# Altium project roach2_project rev2.PrjPCB (part 13 of 13)
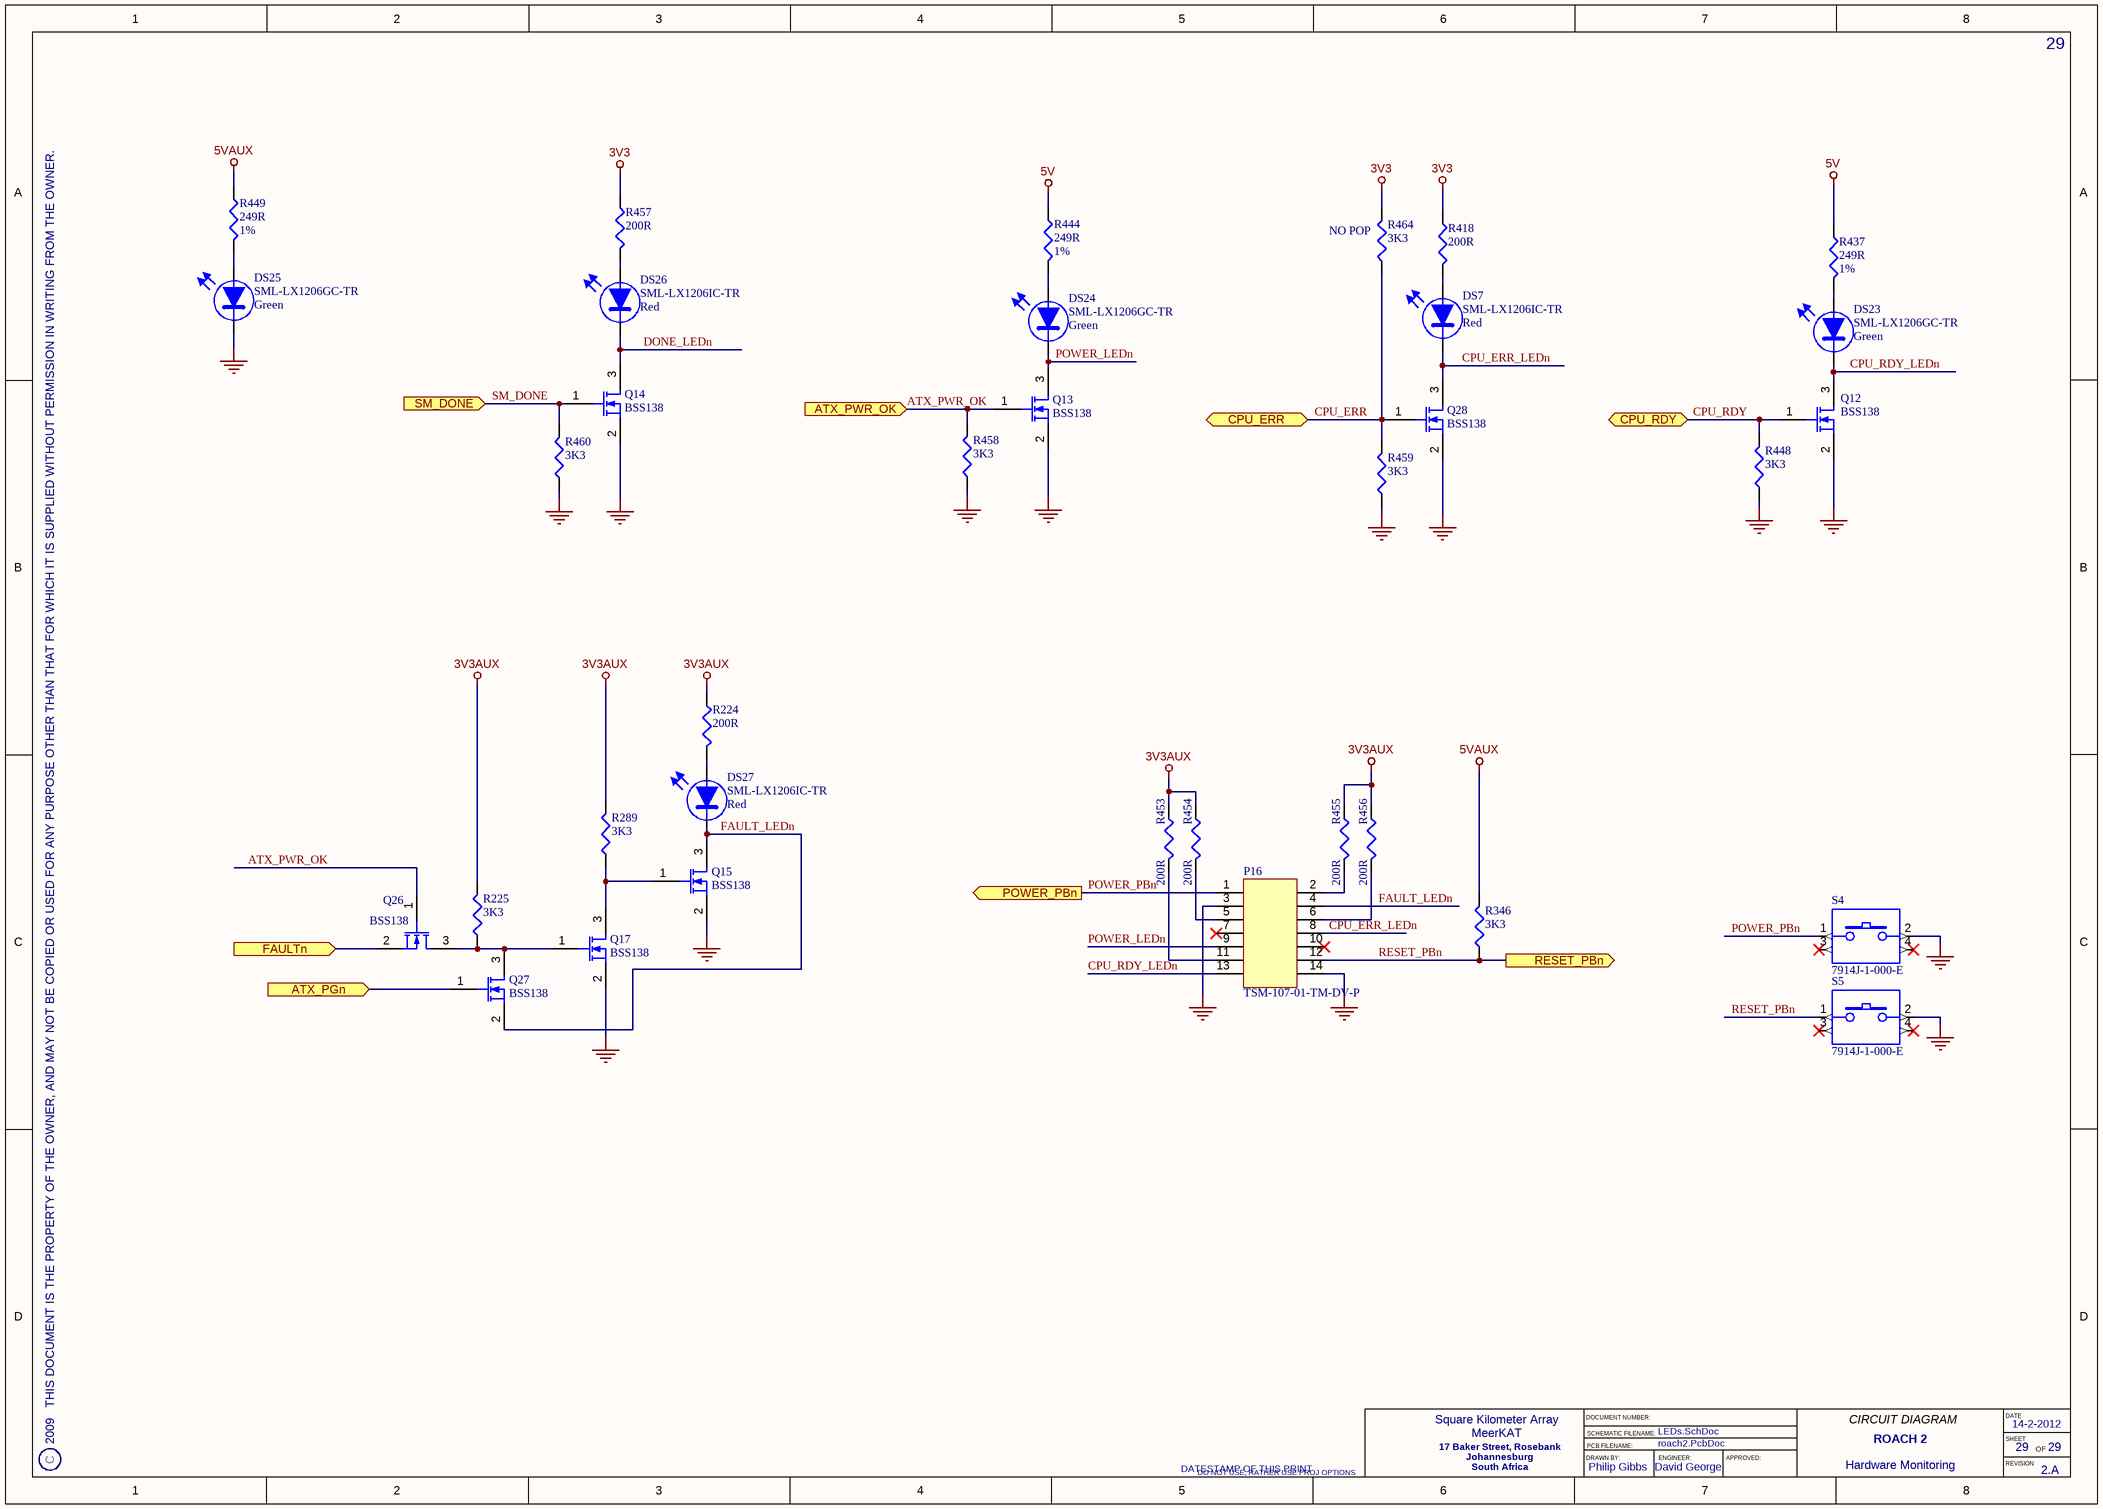
[diagram p27: LEDs.SchDoc]

## Nets that join several sheets (continued)
SM_RDWRn: ppc_serial (R143.2), v6_config_io_16_17_21_22 (U1.J10)
SYS_CLK_N: gpio_led (U72.4), v6_io_34_35_36_37_38 (U1.AP12)
SYS_CLK_P: gpio_led (U72.5), v6_io_34_35_36_37_38 (U1.AP11)
SYS_PORn: power_supply (R20.2), ppc_cpld (U46.99), ppc_extbus (U30.B5), ppc_net (R231.1), ppc_serial (U31.6 U83.6), ppc_sys (5 pins), v6_net (R402.1)
SYS_WPn: ppc_cpld (R343.1 U46.32), ppc_extbus (U30.B4), ppc_serial (Q11.1)
THERM_ALERTn: hwmon_1 (R75.1 U15.5 U18.5 U22.12), ppc_sys (R87.1 U2.U34)
TRC_HALT: jtag_levelxlate (P17.11), ppc_serial (R270.2), ppc_sys (P2.7 R96.1 U2.E32)
V6_GPIO0: gpio_led (P15.17 SP36.2 U68.3), v6_io_27_28_32_33 (U1.G31)
V6_GPIO1: gpio_led (P15.15 SP35.2 U68.4), v6_io_27_28_32_33 (U1.H31)
V6_GPIO2: gpio_led (P15.13 SP34.2 U68.5), v6_io_12_13_14_15 (U1.AF32)
V6_GPIO3: gpio_led (P15.11 SP33.2 U68.6), v6_io_12_13_14_15 (U1.AG33)
V6_GPIO4: gpio_led (P15.9 SP32.2 U68.7), v6_io_27_28_32_33 (U1.L30)
V6_GPIO5: gpio_led (P15.7 SP31.2 U68.8), v6_io_27_28_32_33 (U1.H30)
V6_GPIO6: gpio_led (P15.5 SP30.2 U68.9), v6_io_27_28_32_33 (U1.M29)
V6_GPIO7: gpio_led (P15.3 SP29.2 U68.10), v6_io_27_28_32_33 (U1.J30)
V6_GPIO8: gpio_led (P13.17 SP28.2), v6_io_27_28_32_33 (U1.M28)
V6_GPIO9: gpio_led (P13.15 SP27.2), v6_io_27_28_32_33 (U1.K30)
V6_GPIO10: gpio_led (P13.13 SP26.2), v6_io_34_35_36_37_38 (U1.N19)
V6_GPIO11: gpio_led (P13.11 SP25.2), v6_io_34_35_36_37_38 (U1.N20)
V6_GPIO12: gpio_led (P13.9 SP46.2), v6_io_34_35_36_37_38 (U1.H18)
V6_GPIO13: gpio_led (P13.7 SP45.2), v6_io_34_35_36_37_38 (U1.F16)
V6_GPIO14: gpio_led (P13.5 SP44.2), v6_io_27_28_32_33 (U1.E29)
V6_GPIO15: gpio_led (P13.3 SP43.2), v6_io_27_28_32_33 (U1.M27)
V6_IRQn: ppc_sys (R86.1 U2.AD34), v6_io_34_35_36_37_38 (U1.AY17)
V6_TCK: jtag_levelxlate (U77.18), v6_config_io_16_17_21_22 (U1.AN10)
V6_TDI: jtag_levelxlate (R478.2), v6_config_io_16_17_21_22 (U1.AP10)
V6_TDO: jtag_levelxlate (R479.1), v6_config_io_16_17_21_22 (U1.AR10)
V6_THERM_N: hwmon_1 (C611.1 U22.4), v6_config_io_16_17_21_22 (U1.AC21)
V6_THERM_P: hwmon_1 (C611.2 U22.3), v6_config_io_16_17_21_22 (U1.AC22)
V6_TMS: jtag_levelxlate (U79.12), v6_config_io_16_17_21_22 (U1.AN11)
V6NET_TCK: jtag_levelxlate (U77.9), v6_net (U64.L9)
V6NET_TDI: jtag_levelxlate (R485.2), v6_net (U64.L7)
V6NET_TDO: jtag_levelxlate (R486.1), v6_net (U64.K8)
V6NET_TMS: jtag_levelxlate (U79.3), v6_net (U64.L8)
VMON_TCK: hwmon_1 (U16.11), jtag_levelxlate (U79.16)
VMON_TDI: hwmon_1 (U16.10), jtag_levelxlate (R488.2)
VMON_TDO: hwmon_1 (U16.12), jtag_levelxlate (R489.1 U53.3)
VMON_TMS: hwmon_1 (U16.9), jtag_levelxlate (U82.9)
XL.DOEn: jtag_levelxlate (R476.1 U75.3), v6_io_12_13_14_15 (U1.AF35)
XL.PADDR5: jtag_levelxlate (U76.2), v6_io_34_35_36_37_38 (U1.AT14)
XL.PADDR6: jtag_levelxlate (U76.3), v6_io_34_35_36_37_38 (U1.AR14)
XL.PADDR7: jtag_levelxlate (U76.5), v6_io_34_35_36_37_38 (U1.AR15)
XL.PADDR8: jtag_levelxlate (U76.6), v6_io_34_35_36_37_38 (U1.AP15)
XL.PADDR9: jtag_levelxlate (U76.8), v6_io_34_35_36_37_38 (U1.AN13)
XL.PADDR10: jtag_levelxlate (U76.9), v6_io_34_35_36_37_38 (U1.AN14)
XL.PADDR11: jtag_levelxlate (U76.10), v6_io_34_35_36_37_38 (U1.AM12)
XL.PADDR12: jtag_levelxlate (U76.12), v6_io_34_35_36_37_38 (U1.AM13)
XL.PADDR13: jtag_levelxlate (U76.13), v6_io_34_35_36_37_38 (U1.AV14)
XL.PADDR14: jtag_levelxlate (U76.14), v6_io_23_24_25_26 (U1.AJ32)
XL.PADDR15: jtag_levelxlate (U76.15), v6_io_23_24_25_26 (U1.AJ31)
XL.PADDR16: jtag_levelxlate (U76.16), v6_io_23_24_25_26 (U1.AK30)
XL.PADDR17: jtag_levelxlate (U76.17), v6_io_23_24_25_26 (U1.AJ30)
XL.PADDR18: jtag_levelxlate (U76.19), v6_io_23_24_25_26 (U1.AK33)
XL.PADDR19: jtag_levelxlate (U76.20), v6_io_23_24_25_26 (U1.AH30)
XL.PADDR20: jtag_levelxlate (U76.21), v6_io_23_24_25_26 (U1.AH29)
XL.PADDR21: jtag_levelxlate (U76.23), v6_io_23_24_25_26 (U1.AG29)
XL.PADDR22: jtag_levelxlate (U76.24), v6_io_23_24_25_26 (U1.AD30)
XL.PADDR23: jtag_levelxlate (U80.2), v6_io_23_24_25_26 (U1.AC30)
XL.PADDR24: jtag_levelxlate (U76.26), v6_io_34_35_36_37_38 (U1.AY13)
XL.PADDR25: jtag_levelxlate (U76.27), v6_io_34_35_36_37_38 (U1.AV13)
XL.PADDR26: jtag_levelxlate (U80.3), v6_io_23_24_25_26 (U1.AD31)
XL.PADDR27: jtag_levelxlate (U80.5), v6_io_23_24_25_26 (U1.AB31)
XL.PADDR28: jtag_levelxlate (U80.6), v6_io_23_24_25_26 (U1.AC31)
XL.PADDR29: jtag_levelxlate (U80.8), v6_io_23_24_25_26 (U1.AA30)
XL.PBEn0: jtag_levelxlate (U80.13), v6_io_23_24_25_26 (U1.Y30)
XL.PBEn1: jtag_levelxlate (U80.12), v6_io_23_24_25_26 (U1.W31)
XL.PBEn2: jtag_levelxlate (U80.10), v6_io_23_24_25_26 (U1.R32)
XL.PBEn3: jtag_levelxlate (U80.9), v6_io_23_24_25_26 (U1.T32)
XL.PBLASTn: jtag_levelxlate (U80.16), v6_config_io_16_17_21_22 (U1.N34)
XL.PCSn0: jtag_levelxlate (TP43.1 U80.19), v6_config_io_16_17_21_22 (U1.N35)
XL.PCSn1: jtag_levelxlate (U80.17), v6_config_io_16_17_21_22 (U1.L39)
XL.PCSn2: jtag_levelxlate (U80.20), v6_config_io_16_17_21_22 (R260.1 U1.T10)
XL.PDATA0: jtag_levelxlate (U81.2), v6_io_34_35_36_37_38 (U1.AR13)
XL.PDATA1: jtag_levelxlate (U81.3), v6_io_34_35_36_37_38 (U1.AP13)
XL.PDATA2: jtag_levelxlate (U81.5), v6_io_34_35_36_37_38 (U1.AU14)
XL.PDATA3: jtag_levelxlate (U81.6), v6_io_34_35_36_37_38 (U1.AV15)
XL.PDATA4: jtag_levelxlate (U81.8), v6_io_34_35_36_37_38 (U1.AT12)
XL.PDATA5: jtag_levelxlate (U81.9), v6_io_34_35_36_37_38 (U1.AR12)
XL.PDATA6: jtag_levelxlate (U81.11), v6_io_34_35_36_37_38 (U1.BA14)
XL.PDATA7: jtag_levelxlate (U81.12), v6_io_34_35_36_37_38 (U1.BA15)
XL.PDATA8: jtag_levelxlate (U81.13), v6_io_34_35_36_37_38 (U1.AW13)
XL.PDATA9: jtag_levelxlate (U81.14), v6_io_34_35_36_37_38 (U1.AW12)
XL.PDATA10: jtag_levelxlate (U81.16), v6_io_34_35_36_37_38 (U1.BB14)
XL.PDATA11: jtag_levelxlate (U81.17), v6_io_34_35_36_37_38 (U1.BB13)
XL.PDATA12: jtag_levelxlate (U81.19), v6_io_34_35_36_37_38 (U1.AU13)
XL.PDATA13: jtag_levelxlate (U81.20), v6_io_34_35_36_37_38 (U1.AU12)
XL.PDATA14: jtag_levelxlate (U81.22), v6_io_34_35_36_37_38 (U1.AW15)
XL.PDATA15: jtag_levelxlate (U81.23), v6_io_34_35_36_37_38 (U1.AY15)
XL.PDATA16: jtag_levelxlate (U78.2), v6_io_23_24_25_26 (U1.P33)
XL.PDATA17: jtag_levelxlate (U78.3), v6_io_23_24_25_26 (U1.N33)
XL.PDATA18: jtag_levelxlate (U78.5), v6_io_23_24_25_26 (U1.AG31)
XL.PDATA19: jtag_levelxlate (U78.6), v6_io_23_24_25_26 (U1.AH31)
XL.PDATA20: jtag_levelxlate (U78.8), v6_io_23_24_25_26 (U1.R30)
XL.PDATA21: jtag_levelxlate (U78.9), v6_io_23_24_25_26 (U1.T30)
XL.PDATA22: jtag_levelxlate (U78.11), v6_io_23_24_25_26 (U1.AF31)
XL.PDATA23: jtag_levelxlate (U78.12), v6_io_23_24_25_26 (U1.AG32)
XL.PDATA24: jtag_levelxlate (U78.13), v6_io_23_24_25_26 (U1.U31)
XL.PDATA25: jtag_levelxlate (U78.14), v6_io_23_24_25_26 (U1.T31)
XL.PDATA26: jtag_levelxlate (U78.16), v6_io_23_24_25_26 (U1.AL32)
XL.PDATA27: jtag_levelxlate (U78.17), v6_io_23_24_25_26 (U1.AK32)
XL.PDATA28: jtag_levelxlate (U78.19), v6_io_23_24_25_26 (U1.R33)
XL.PDATA29: jtag_levelxlate (U78.20), v6_io_23_24_25_26 (U1.P32)
XL.PDATA30: jtag_levelxlate (U78.22), v6_io_23_24_25_26 (U1.AH33)
XL.PDATA31: jtag_levelxlate (TP42.1 U78.23), v6_io_23_24_25_26 (U1.AJ33)
XL.PERCLK: jtag_levelxlate (6 pins), v6_config_io_16_17_21_22 (U1.K10), v6_io_34_35_36_37_38 (U1.AY14)
XL.POEn: jtag_levelxlate (U80.14), v6_io_23_24_25_26 (U1.AA31)
XL.PRDY: jtag_levelxlate (R230.1 U86.1), v6_config_io_16_17_21_22 (U1.L40)
XL.PWRn: jtag_levelxlate (U80.15), v6_io_23_24_25_26 (U1.V31)
ZDOK0.CLK0_N: v6_io_23_24_25_26 (U1.K42), zdoks (P10.C20)
ZDOK0.CLK0_P: v6_io_23_24_25_26 (U1.J42), zdoks (P10.C19)
ZDOK0.CLK1_N: v6_io_23_24_25_26 (U1.P31), zdoks (P10.F20)
ZDOK0.CLK1_P: v6_io_23_24_25_26 (U1.P30), zdoks (P10.F19)
ZDOK0.DP_N0: v6_io_23_24_25_26 (U1.R27), zdoks (P10.A2)
ZDOK0.DP_N1: v6_io_23_24_25_26 (U1.N31), zdoks (P10.A4)
ZDOK0.DP_N2: v6_io_23_24_25_26 (U1.L36), zdoks (P10.A6)
ZDOK0.DP_N3: v6_io_23_24_25_26 (U1.K34), zdoks (P10.A8)
ZDOK0.DP_N4: v6_io_23_24_25_26 (U1.H35), zdoks (P10.A10)
ZDOK0.DP_N5: v6_io_23_24_25_26 (U1.G42), zdoks (P10.A12)
ZDOK0.DP_N6: v6_io_23_24_25_26 (U1.G36), zdoks (P10.A14)
ZDOK0.DP_N7: v6_io_23_24_25_26 (U1.C39), zdoks (P10.A16)
ZDOK0.DP_N8: v6_io_23_24_25_26 (U1.A39), zdoks (P10.A18)
ZDOK0.DP_N9: v6_io_23_24_25_26 (U1.B42), zdoks (P10.A20)
ZDOK0.DP_N10: v6_io_23_24_25_26 (U1.P28), zdoks (P10.D2)
ZDOK0.DP_N11: v6_io_23_24_25_26 (U1.L37), zdoks (P10.D4)
ZDOK0.DP_N12: v6_io_23_24_25_26 (U1.K32), zdoks (P10.D6)
ZDOK0.DP_N13: v6_io_23_24_25_26 (U1.K40), zdoks (P10.D8)
ZDOK0.DP_N14: v6_io_23_24_25_26 (U1.H41), zdoks (P10.D10)
ZDOK0.DP_N15: v6_io_23_24_25_26 (U1.G38), zdoks (P10.D12)
ZDOK0.DP_N16: v6_io_23_24_25_26 (U1.F42), zdoks (P10.D14)
ZDOK0.DP_N17: v6_io_23_24_25_26 (U1.C41), zdoks (P10.D16)
ZDOK0.DP_N18: v6_io_23_24_25_26 (U1.E38), zdoks (P10.D18)
ZDOK0.DP_N19: v6_io_23_24_25_26 (U1.A37), zdoks (P10.D20)
ZDOK0.DP_N20: v6_io_23_24_25_26 (U1.R29), zdoks (P10.C2)
ZDOK0.DP_N21: v6_config_io_16_17_21_22 (U1.M37), v6_io_23_24_25_26 (U1.M32), zdoks (P10.C4)
ZDOK0.DP_N22: v6_io_23_24_25_26 (U1.N30), zdoks (P10.C6)
ZDOK0.DP_N23: v6_io_23_24_25_26 (U1.M34), zdoks (P10.C8)
ZDOK0.DP_N24: v6_io_23_24_25_26 (U1.H34), zdoks (P10.C10)
ZDOK0.DP_N25: v6_io_23_24_25_26 (U1.G39), zdoks (P10.C12)
ZDOK0.DP_N26: v6_io_23_24_25_26 (U1.E37), zdoks (P10.C14)
ZDOK0.DP_N27: v6_io_23_24_25_26 (U1.D41), zdoks (P10.C16)
ZDOK0.DP_N28: v6_io_23_24_25_26 (U1.A41), zdoks (P10.C18)
ZDOK0.DP_N29: v6_io_23_24_25_26 (U1.L32), zdoks (P10.F2)
ZDOK0.DP_N30: v6_io_23_24_25_26 (U1.J36), zdoks (P10.F4)
ZDOK0.DP_N31: v6_io_23_24_25_26 (U1.J41), zdoks (P10.F6)
ZDOK0.DP_N32: v6_io_23_24_25_26 (U1.J38), zdoks (P10.F8)
ZDOK0.DP_N33: v6_io_23_24_25_26 (U1.H38), zdoks (P10.F10)
ZDOK0.DP_N34: v6_io_23_24_25_26 (U1.E40), zdoks (P10.F12)
ZDOK0.DP_N35: v6_io_23_24_25_26 (U1.F41), zdoks (P10.F14)
ZDOK0.DP_N36: v6_io_23_24_25_26 (U1.F36), zdoks (P10.F16)
ZDOK0.DP_N37: v6_io_23_24_25_26 (U1.C38), zdoks (P10.F18)
ZDOK0.DP_P0: v6_io_23_24_25_26 (U1.P27), zdoks (P10.A1)
ZDOK0.DP_P1: v6_io_23_24_25_26 (U1.M31), zdoks (P10.A3)
ZDOK0.DP_P2: v6_io_23_24_25_26 (U1.L35), zdoks (P10.A5)
ZDOK0.DP_P3: v6_io_23_24_25_26 (U1.K35), zdoks (P10.A7)
ZDOK0.DP_P4: v6_io_23_24_25_26 (U1.J35), zdoks (P10.A9)
ZDOK0.DP_P5: v6_io_23_24_25_26 (U1.G41), zdoks (P10.A11)
ZDOK0.DP_P6: v6_io_23_24_25_26 (U1.H36), zdoks (P10.A13)
ZDOK0.DP_P7: v6_io_23_24_25_26 (U1.B39), zdoks (P10.A15)
ZDOK0.DP_P8: v6_io_23_24_25_26 (U1.B38), zdoks (P10.A17)
ZDOK0.DP_P9: v6_io_23_24_25_26 (U1.B41), zdoks (P10.A19)
ZDOK0.DP_P10: v6_io_23_24_25_26 (U1.N28), zdoks (P10.D1)
ZDOK0.DP_P11: v6_io_23_24_25_26 (U1.K37), zdoks (P10.D3)
ZDOK0.DP_P12: v6_io_23_24_25_26 (U1.K33), zdoks (P10.D5)
ZDOK0.DP_P13: v6_io_23_24_25_26 (U1.K39), zdoks (P10.D7)
ZDOK0.DP_P14: v6_io_23_24_25_26 (U1.H40), zdoks (P10.D9)
ZDOK0.DP_P15: v6_io_23_24_25_26 (U1.G37), zdoks (P10.D11)
ZDOK0.DP_P16: v6_io_23_24_25_26 (U1.E42), zdoks (P10.D13)
ZDOK0.DP_P17: v6_io_23_24_25_26 (U1.C40), zdoks (P10.D15)
ZDOK0.DP_P18: v6_io_23_24_25_26 (U1.E39), zdoks (P10.D17)
ZDOK0.DP_P19: v6_io_23_24_25_26 (U1.B37), zdoks (P10.D19)
ZDOK0.DP_P20: v6_io_23_24_25_26 (U1.R28), zdoks (P10.C1)
ZDOK0.DP_P21: v6_config_io_16_17_21_22 (U1.M36), v6_io_23_24_25_26 (U1.M33), zdoks (P10.C3)
ZDOK0.DP_P22: v6_io_23_24_25_26 (U1.N29), zdoks (P10.C5)
ZDOK0.DP_P23: v6_io_23_24_25_26 (U1.L34), zdoks (P10.C7)
ZDOK0.DP_P24: v6_io_23_24_25_26 (U1.G34), zdoks (P10.C9)
ZDOK0.DP_P25: v6_io_23_24_25_26 (U1.F39), zdoks (P10.C11)
ZDOK0.DP_P26: v6_io_23_24_25_26 (U1.F37), zdoks (P10.C13)
ZDOK0.DP_P27: v6_io_23_24_25_26 (U1.D42), zdoks (P10.C15)
ZDOK0.DP_P28: v6_io_23_24_25_26 (U1.A40), zdoks (P10.C17)
ZDOK0.DP_P29: v6_io_23_24_25_26 (U1.L31), zdoks (P10.F1)
ZDOK0.DP_P30: v6_io_23_24_25_26 (U1.J37), zdoks (P10.F3)
ZDOK0.DP_P31: v6_io_23_24_25_26 (U1.J40), zdoks (P10.F5)
ZDOK0.DP_P32: v6_io_23_24_25_26 (U1.K38), zdoks (P10.F7)
ZDOK0.DP_P33: v6_io_23_24_25_26 (U1.H39), zdoks (P10.F9)
ZDOK0.DP_P34: v6_io_23_24_25_26 (U1.D40), zdoks (P10.F11)
ZDOK0.DP_P35: v6_io_23_24_25_26 (U1.F40), zdoks (P10.F13)
ZDOK0.DP_P36: v6_io_23_24_25_26 (U1.F35), zdoks (P10.F15)
ZDOK0.DP_P37: v6_io_23_24_25_26 (U1.D38), zdoks (P10.F17)
ZDOK1.CLK0_N: v6_io_23_24_25_26 (U1.V30), zdoks (P11.C20)
ZDOK1.CLK0_P: v6_io_23_24_25_26 (U1.W30), zdoks (P11.C19)
ZDOK1.CLK1_N: v6_io_23_24_25_26 (U1.AF30), zdoks (P11.F20)
ZDOK1.CLK1_P: v6_io_23_24_25_26 (U1.AE30), zdoks (P11.F19)
ZDOK1.DP_N0: v6_config_io_16_17_21_22 (U1.Y34), zdoks (P11.A2)
ZDOK1.DP_N1: v6_config_io_16_17_21_22 (U1.Y37), zdoks (P11.A4)
ZDOK1.DP_N2: v6_config_io_16_17_21_22 (U1.V35), zdoks (P11.A6)
ZDOK1.DP_N3: v6_config_io_16_17_21_22 (U1.U33), zdoks (P11.A8)
ZDOK1.DP_N4: v6_config_io_16_17_21_22 (U1.U41), zdoks (P11.A10)
ZDOK1.DP_N5: v6_config_io_16_17_21_22 (U1.T37), zdoks (P11.A12)
ZDOK1.DP_N6: v6_config_io_16_17_21_22 (U1.R34), zdoks (P11.A14)
ZDOK1.DP_N7: v6_config_io_16_17_21_22 (U1.P35), zdoks (P11.A16)
ZDOK1.DP_N8: v6_config_io_16_17_21_22 (U1.M42), zdoks (P11.A18)
ZDOK1.DP_N9: v6_config_io_16_17_21_22 (U1.L42), zdoks (P11.A20)
ZDOK1.DP_N10: v6_config_io_16_17_21_22 (U1.Y32), zdoks (P11.D2)
ZDOK1.DP_N11: v6_config_io_16_17_21_22 (U1.AA39), zdoks (P11.D4)
ZDOK1.DP_N12: v6_config_io_16_17_21_22 (U1.W33), zdoks (P11.D6)
ZDOK1.DP_N13: v6_config_io_16_17_21_22 (U1.W41), zdoks (P11.D8)
ZDOK1.DP_N14: v6_config_io_16_17_21_22 (U1.V39), zdoks (P11.D10)
ZDOK1.DP_N15: v6_config_io_16_17_21_22 (U1.T36), zdoks (P11.D12)
ZDOK1.DP_N16: v6_config_io_16_17_21_22 (U1.T42), zdoks (P11.D14)
ZDOK1.DP_N17: v6_config_io_16_17_21_22 (U1.P38), zdoks (P11.D16)
ZDOK1.DP_N19: v6_config_io_16_17_21_22 (U1.N41), zdoks (P11.D20)
ZDOK1.DP_N20: v6_config_io_16_17_21_22 (U1.Y35), zdoks (P11.C2)
ZDOK1.DP_N21: v6_config_io_16_17_21_22 (U1.Y33), zdoks (P11.C4)
ZDOK1.DP_N22: v6_config_io_16_17_21_22 (U1.V36), zdoks (P11.C6)
ZDOK1.DP_N23: v6_config_io_16_17_21_22 (U1.W40), zdoks (P11.C8)
ZDOK1.DP_N24: v6_config_io_16_17_21_22 (U1.U38), zdoks (P11.C10)
ZDOK1.DP_N25: v6_config_io_16_17_21_22 (U1.R38), zdoks (P11.C12)
ZDOK1.DP_N26: v6_config_io_16_17_21_22 (U1.R42), zdoks (P11.C14)
ZDOK1.DP_N27: v6_config_io_16_17_21_22 (U1.P41), zdoks (P11.C16)
ZDOK1.DP_N28: v6_config_io_16_17_21_22 (U1.M39), zdoks (P11.C18)
ZDOK1.DP_N29: v6_config_io_16_17_21_22 (U1.AA37), zdoks (P11.F2)
ZDOK1.DP_N30: v6_config_io_16_17_21_22 (U1.Y42), zdoks (P11.F4)
ZDOK1.DP_N31: v6_config_io_16_17_21_22 (U1.Y39), zdoks (P11.F6)
ZDOK1.DP_N32: v6_config_io_16_17_21_22 (U1.W38), zdoks (P11.F8)
ZDOK1.DP_N33: v6_config_io_16_17_21_22 (U1.U34), zdoks (P11.F10)
ZDOK1.DP_N34: v6_config_io_16_17_21_22 (U1.T35), zdoks (P11.F12)
ZDOK1.DP_N35: v6_config_io_16_17_21_22 (U1.T40), zdoks (P11.F14)
ZDOK1.DP_N36: v6_config_io_16_17_21_22 (U1.P37), zdoks (P11.F16)
ZDOK1.DP_N37: v6_config_io_16_17_21_22 (U1.N39), zdoks (P11.F18)
ZDOK1.DP_P0: v6_config_io_16_17_21_22 (U1.AA34), zdoks (P11.A1)
ZDOK1.DP_P1: v6_config_io_16_17_21_22 (U1.W37), zdoks (P11.A3)
ZDOK1.DP_P2: v6_config_io_16_17_21_22 (U1.W35), zdoks (P11.A5)
ZDOK1.DP_P3: v6_config_io_16_17_21_22 (U1.U32), zdoks (P11.A7)
ZDOK1.DP_P4: v6_config_io_16_17_21_22 (U1.U42), zdoks (P11.A9)
ZDOK1.DP_P5: v6_config_io_16_17_21_22 (U1.R37), zdoks (P11.A11)
ZDOK1.DP_P6: v6_config_io_16_17_21_22 (U1.R35), zdoks (P11.A13)
ZDOK1.DP_P7: v6_config_io_16_17_21_22 (U1.P36), zdoks (P11.A15)
ZDOK1.DP_P8: v6_config_io_16_17_21_22 (U1.M41), zdoks (P11.A17)
ZDOK1.DP_P9: v6_config_io_16_17_21_22 (U1.L41), zdoks (P11.A19)
ZDOK1.DP_P10: v6_config_io_16_17_21_22 (U1.AA32), zdoks (P11.D1)
ZDOK1.DP_P11: v6_config_io_16_17_21_22 (U1.Y38), zdoks (P11.D3)
ZDOK1.DP_P12: v6_config_io_16_17_21_22 (U1.V33), zdoks (P11.D5)
ZDOK1.DP_P13: v6_config_io_16_17_21_22 (U1.V41), zdoks (P11.D7)
ZDOK1.DP_P14: v6_config_io_16_17_21_22 (U1.U39), zdoks (P11.D9)
ZDOK1.DP_P15: v6_config_io_16_17_21_22 (U1.U36), zdoks (P11.D11)
ZDOK1.DP_P16: v6_config_io_16_17_21_22 (U1.T41), zdoks (P11.D13)
ZDOK1.DP_P17: v6_config_io_16_17_21_22 (U1.R39), zdoks (P11.D15)
ZDOK1.DP_P19: v6_config_io_16_17_21_22 (U1.N40), zdoks (P11.D19)
ZDOK1.DP_P20: v6_config_io_16_17_21_22 (U1.AA35), zdoks (P11.C1)
ZDOK1.DP_P21: v6_config_io_16_17_21_22 (U1.W32), zdoks (P11.C3)
ZDOK1.DP_P22: v6_config_io_16_17_21_22 (U1.W36), zdoks (P11.C5)
ZDOK1.DP_P23: v6_config_io_16_17_21_22 (U1.V40), zdoks (P11.C7)
ZDOK1.DP_P24: v6_config_io_16_17_21_22 (U1.U37), zdoks (P11.C9)
ZDOK1.DP_P25: v6_config_io_16_17_21_22 (U1.T39), zdoks (P11.C11)
ZDOK1.DP_P26: v6_config_io_16_17_21_22 (U1.P42), zdoks (P11.C13)
ZDOK1.DP_P27: v6_config_io_16_17_21_22 (U1.P40), zdoks (P11.C15)
ZDOK1.DP_P28: v6_config_io_16_17_21_22 (U1.M38), zdoks (P11.C17)
ZDOK1.DP_P29: v6_config_io_16_17_21_22 (U1.AA36), zdoks (P11.F1)
ZDOK1.DP_P30: v6_config_io_16_17_21_22 (U1.W42), zdoks (P11.F3)
ZDOK1.DP_P31: v6_config_io_16_17_21_22 (U1.Y40), zdoks (P11.F5)
ZDOK1.DP_P32: v6_config_io_16_17_21_22 (U1.V38), zdoks (P11.F7)
ZDOK1.DP_P33: v6_config_io_16_17_21_22 (U1.V34), zdoks (P11.F9)
ZDOK1.DP_P34: v6_config_io_16_17_21_22 (U1.T34), zdoks (P11.F11)
ZDOK1.DP_P35: v6_config_io_16_17_21_22 (U1.R40), zdoks (P11.F13)
ZDOK1.DP_P36: v6_config_io_16_17_21_22 (U1.N36), zdoks (P11.F15)
ZDOK1.DP_P37: v6_config_io_16_17_21_22 (U1.N38), zdoks (P11.F17)